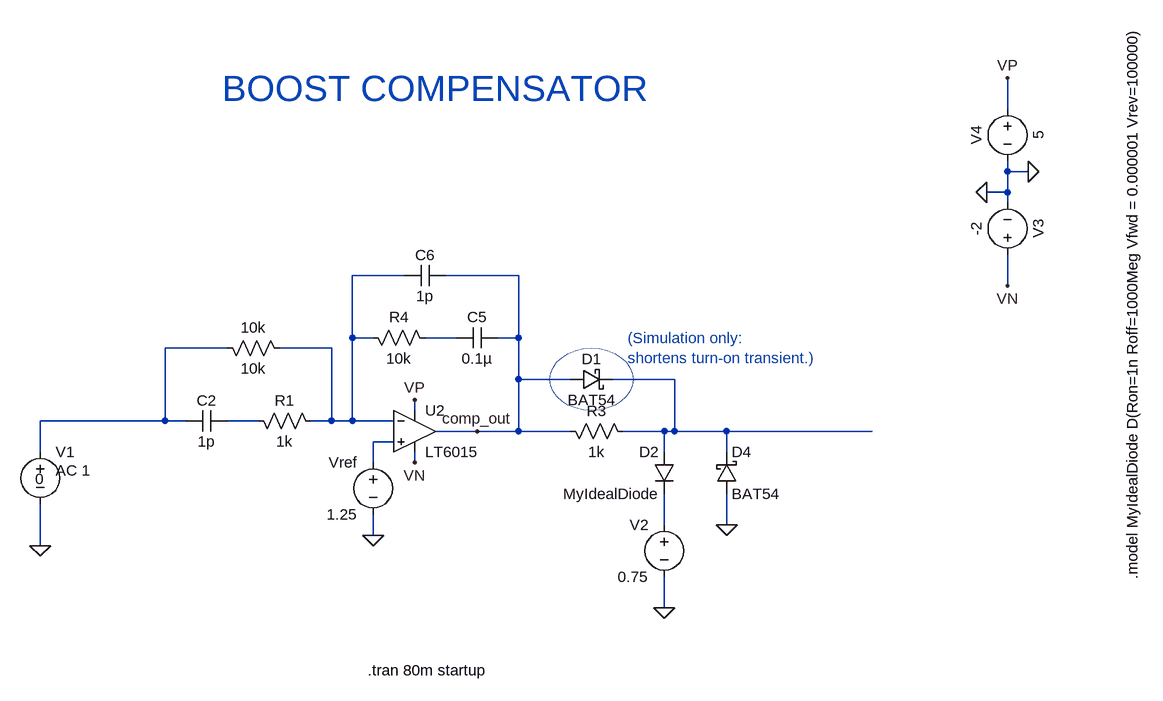
[diagram p0: schematic CL_boost_compensator.asc]
CL_boost_compensator.asc, the LTspice schematic file:
Version 4
SHEET 1 5968 3124
WIRE 4080 960 4080 912
WIRE 4080 1056 4080 1040
WIRE 4112 1056 4080 1056
WIRE 4080 1088 4080 1056
WIRE 4080 1088 4048 1088
WIRE 4080 1104 4080 1088
WIRE 3152 1216 3072 1216
WIRE 3328 1216 3216 1216
WIRE 4080 1232 4080 1184
WIRE 3072 1312 3072 1216
WIRE 3104 1312 3072 1312
WIRE 3232 1312 3184 1312
WIRE 3328 1312 3328 1216
WIRE 3328 1312 3296 1312
WIRE 2880 1328 2784 1328
WIRE 3040 1328 2960 1328
WIRE 3328 1376 3328 1312
WIRE 3408 1376 3328 1376
WIRE 3568 1376 3472 1376
WIRE 3168 1424 3168 1408
WIRE 2784 1440 2784 1328
WIRE 2784 1440 2592 1440
WIRE 2816 1440 2784 1440
WIRE 2928 1440 2880 1440
WIRE 3040 1440 3040 1328
WIRE 3040 1440 3008 1440
WIRE 3072 1440 3072 1312
WIRE 3072 1440 3040 1440
WIRE 3136 1440 3072 1440
WIRE 3264 1456 3200 1456
WIRE 3328 1456 3328 1376
WIRE 3328 1456 3264 1456
WIRE 3408 1456 3328 1456
WIRE 3552 1456 3488 1456
WIRE 3568 1456 3568 1376
WIRE 3568 1456 3552 1456
WIRE 3648 1456 3568 1456
WIRE 3872 1456 3648 1456
WIRE 3136 1472 3104 1472
WIRE 2592 1488 2592 1440
WIRE 3552 1488 3552 1456
WIRE 3648 1488 3648 1456
WIRE 3104 1504 3104 1472
WIRE 3168 1504 3168 1488
WIRE 3552 1600 3552 1552
WIRE 3648 1600 3648 1552
WIRE 3104 1616 3104 1584
WIRE 2592 1632 2592 1568
WIRE 3552 1728 3552 1680
FLAG 4080 912 VP
FLAG 3104 1616 0
FLAG 4112 1056 0
FLAG 4048 1088 0
FLAG 4080 1232 VN
FLAG 3552 1728 0
FLAG 3648 1600 0
FLAG 2592 1632 0
FLAG 3168 1408 VP
FLAG 3168 1504 VN
FLAG 3264 1456 comp_out
SYMBOL Opamps\\LT6015 3168 1456 R0
SYMATTR InstName U2
SYMBOL voltage 3104 1488 M0
WINDOW 123 0 0 Left 0
WINDOW 39 0 0 Left 0
SYMATTR InstName Vref
SYMATTR Value 1.25
SYMBOL voltage 4080 1200 M180
WINDOW 0 32 56 VTop 2
WINDOW 3 -32 56 VBottom 2
WINDOW 123 0 0 Left 0
WINDOW 39 0 0 Left 0
SYMATTR InstName V3
SYMATTR Value -2
SYMBOL voltage 4080 944 M0
WINDOW 0 32 56 VTop 2
WINDOW 3 -32 56 VBottom 2
WINDOW 123 0 0 Left 0
WINDOW 39 0 0 Left 0
SYMATTR InstName V4
SYMATTR Value 5
SYMBOL res 3392 1440 M90
WINDOW 0 0 56 VBottom 2
WINDOW 3 32 56 VTop 2
SYMATTR InstName R3
SYMATTR Value 1k
SYMBOL voltage 3552 1584 M0
WINDOW 123 0 0 Left 0
WINDOW 39 0 0 Left 0
SYMATTR InstName V2
SYMATTR Value 0.75
SYMBOL schottky 3632 1552 M180
WINDOW 0 24 64 Left 2
WINDOW 3 24 0 Left 2
SYMATTR InstName D4
SYMATTR Value BAT54
SYMATTR Description Diode
SYMATTR Type diode
SYMBOL cap 2816 1424 M90
WINDOW 0 0 32 VBottom 2
WINDOW 3 32 32 VTop 2
SYMATTR InstName C2
SYMATTR Value 1p
SYMBOL cap 3232 1296 M90
WINDOW 0 0 32 VBottom 2
WINDOW 3 32 32 VTop 2
SYMATTR InstName C5
SYMATTR Value 0.1µ
SYMBOL cap 3152 1200 M90
WINDOW 0 0 32 VBottom 2
WINDOW 3 32 32 VTop 2
SYMATTR InstName C6
SYMATTR Value 1p
SYMBOL res 2912 1424 M90
WINDOW 0 0 56 VBottom 2
WINDOW 3 32 56 VTop 2
SYMATTR InstName R1
SYMATTR Value 1k
SYMBOL res 3088 1296 M90
WINDOW 0 0 56 VBottom 2
WINDOW 3 32 56 VTop 2
SYMATTR InstName R4
SYMATTR Value 10k
SYMBOL res 2864 1312 M90
WINDOW 0 0 56 VBottom 2
WINDOW 3 32 56 VTop 2
SYMATTR InstName 10k
SYMATTR Value 10k
SYMBOL voltage 2592 1472 R0
WINDOW 123 24 44 Left 2
WINDOW 39 0 0 Left 0
WINDOW 3 -8 57 Left 2
SYMATTR Value2 AC 1
SYMATTR Value 0
SYMATTR InstName V1
SYMBOL diode 3568 1488 M0
SYMATTR InstName D2
SYMATTR Value MyIdealDiode
SYMBOL schottky 3408 1360 M90
WINDOW 0 0 32 VBottom 2
WINDOW 3 32 32 VTop 2
SYMATTR InstName D1
SYMATTR Value BAT54
SYMATTR Description Diode
SYMATTR Type diode
TEXT 3096 1824 Left 2 !.tran 80m startup
TEXT 2872 928 Left 5 ;BOOST COMPENSATOR
TEXT 4272 824 VRight 2 !.model MyIdealDiode D(Ron=1n Roff=1000Meg Vfwd = 0.000001 Vrev=100000)
TEXT 3496 1312 Left 2 ;(Simulation only:\nshortens turn-on transient.)
CIRCLE Normal 3504 1424 3376 1328 2

The netlist it stands for:
* CL_boost_compensator.asc
XU2 N006 N001 VP VN comp_out LT6016  ; LT6015, pins In+ In- V+ V- OUT
Vref N006 0 1.25
V3 VN 0 -2
V4 VP 0 5
R3 comp_out N004 1k
V2 N007 0 0.75
D4 0 N004 BAT54
C2 N003 N005 1p
C5 N002 comp_out 0.1µ
C6 N001 comp_out 1p
R1 N005 N001 1k
R4 N001 N002 10k
R§10k N003 N001 10k
V1 N003 0 0 AC 1
D2 N004 N007 MyIdealDiode
D1 comp_out N004 BAT54
.model D D
.lib standard.dio
.tran 80m startup
* BOOST COMPENSATOR
.model MyIdealDiode D(Ron=1n Roff=1000Meg Vfwd = 0.000001 Vrev=100000)
* (Simulation only:
* shortens turn-on transient.)
.lib LTC2.lib
.backanno
.end